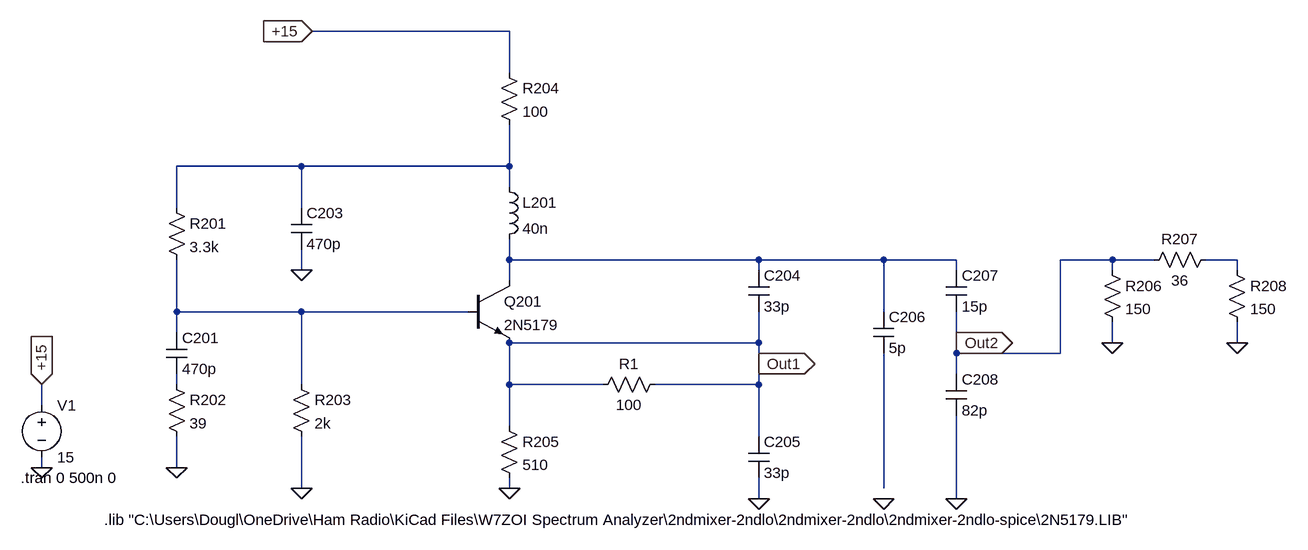
[diagram p0: schematic 2nd-lo.asc]
2nd-lo.asc, the LTspice schematic file:
Version 4
SHEET 1 1536 680
WIRE 368 -320 64 -320
WIRE 368 -256 368 -320
WIRE 48 -112 -144 -112
WIRE 368 -112 368 -176
WIRE 368 -112 48 -112
WIRE 368 -80 368 -112
WIRE -144 -48 -144 -112
WIRE 48 -48 48 -112
WIRE 368 32 368 0
WIRE 752 32 368 32
WIRE 944 32 752 32
WIRE 1056 32 944 32
WIRE 1296 32 1216 32
WIRE 1360 32 1296 32
WIRE 1488 32 1440 32
WIRE 48 48 48 16
WIRE 752 48 752 32
WIRE 1056 48 1056 32
WIRE 1296 48 1296 32
WIRE 1488 48 1488 32
WIRE 368 64 368 32
WIRE -144 112 -144 32
WIRE 48 112 -144 112
WIRE 304 112 48 112
WIRE 944 112 944 32
WIRE -144 144 -144 112
WIRE 752 160 752 112
WIRE 752 160 368 160
WIRE 1056 160 1056 112
WIRE 1296 160 1296 128
WIRE 1488 160 1488 128
WIRE 1056 176 1056 160
WIRE 1216 176 1216 32
WIRE 1216 176 1056 176
WIRE 752 192 752 160
WIRE 1056 208 1056 176
WIRE -144 224 -144 208
WIRE 48 224 48 112
WIRE 368 224 368 160
WIRE 512 224 368 224
WIRE 752 224 752 192
WIRE 752 224 592 224
WIRE -352 256 -352 224
WIRE 368 288 368 224
WIRE 752 304 752 224
WIRE -352 352 -352 336
WIRE -144 352 -144 304
WIRE 48 384 48 304
WIRE 368 384 368 368
WIRE 944 384 944 176
WIRE 752 400 752 368
WIRE 1056 400 1056 272
FLAG -352 352 0
FLAG -352 224 +15
IOPIN -352 224 In
FLAG 64 -320 +15
IOPIN 64 -320 In
FLAG -144 352 0
FLAG 752 400 0
FLAG 368 384 0
FLAG 48 384 0
FLAG 48 48 0
FLAG 944 400 0
FLAG 1056 400 0
FLAG 1296 160 0
FLAG 1488 160 0
FLAG 752 192 Out1
IOPIN 752 192 Out
FLAG 1056 160 Out2
IOPIN 1056 160 Out
SYMBOL npn 304 64 R0
SYMATTR InstName Q201
SYMATTR Value 2N5179
SYMBOL voltage -352 240 R0
WINDOW 123 0 0 Left 0
WINDOW 39 0 0 Left 0
SYMATTR InstName V1
SYMATTR Value 15
SYMBOL res -160 -64 R0
SYMATTR InstName R201
SYMATTR Value 3.3k
SYMBOL res -160 208 R0
SYMATTR InstName R202
SYMATTR Value 39
SYMBOL cap 736 304 R0
SYMATTR InstName C205
SYMATTR Value 33p
SYMBOL cap 736 48 R0
SYMATTR InstName C204
SYMATTR Value 33p
SYMBOL ind 352 -96 R0
SYMATTR InstName L201
SYMATTR Value 40n
SYMBOL res 352 272 R0
SYMATTR InstName R205
SYMATTR Value 510
SYMBOL cap -160 144 R0
SYMATTR InstName C201
SYMATTR Value 470p
SYMBOL res 32 208 R0
SYMATTR InstName R203
SYMATTR Value 2k
SYMBOL res 352 -272 R0
SYMATTR InstName R204
SYMATTR Value 100
SYMBOL cap 32 -48 R0
SYMATTR InstName C203
SYMATTR Value 470p
SYMBOL cap 928 112 R0
SYMATTR InstName C206
SYMATTR Value 5p
SYMBOL cap 1040 48 R0
SYMATTR InstName C207
SYMATTR Value 15p
SYMBOL cap 1040 208 R0
SYMATTR InstName C208
SYMATTR Value 82p
SYMBOL res 608 208 R90
WINDOW 0 0 56 VBottom 2
WINDOW 3 32 56 VTop 2
SYMATTR InstName R1
SYMATTR Value 100
SYMBOL res 1280 32 R0
SYMATTR InstName R206
SYMATTR Value 150
SYMBOL res 1472 32 R0
SYMATTR InstName R208
SYMATTR Value 150
SYMBOL res 1456 16 R90
WINDOW 0 0 56 VBottom 2
WINDOW 3 32 56 VTop 2
SYMATTR InstName R207
SYMATTR Value 36
TEXT -384 368 Left 2 !.tran 0 500n 0
TEXT -256 432 Left 2 !.lib "C:\\Users\\Dougl\\OneDrive\\Ham Radio\\KiCad Files\\W7ZOI Spectrum Analyzer\\2ndmixer-2ndlo\\2ndmixer-2ndlo\\2ndmixer-2ndlo-spice\\2N5179.LIB"

The netlist it stands for:
* 2nd-lo.asc
Q201 N002 N004 Out1 0 2N5179
V1 +15 0 15
R201 N001 N004 3.3k
R202 N005 0 39
C205 Out1 0 33p
C204 N002 Out1 33p
L201 N001 N002 40n
R205 Out1 0 510
C201 N004 N005 470p
R203 N004 0 2k
R204 +15 N001 100
C203 N001 0 470p
C206 N002 N006 5p
C207 N002 Out2 15p
C208 Out2 0 82p
R1 Out1 Out1 100
R206 Out2 0 150
R208 N003 0 150
R207 N003 Out2 36
.model NPN NPN
.model PNP PNP
.lib standard.bjt
.tran 0 500n 0
.lib "C:\Users\Dougl\OneDrive\Ham Radio\KiCad Files\W7ZOI Spectrum Analyzer\2ndmixer-2ndlo\2ndmixer-2ndlo\2ndmixer-2ndlo-spice\2N5179.LIB"
.backanno
.end